# Altium schematic sheet УШЯИ.467444.130Э3_4.SchDoc
size 420 x 297 mm; SheetNumber: 4; SheetTotal: 5
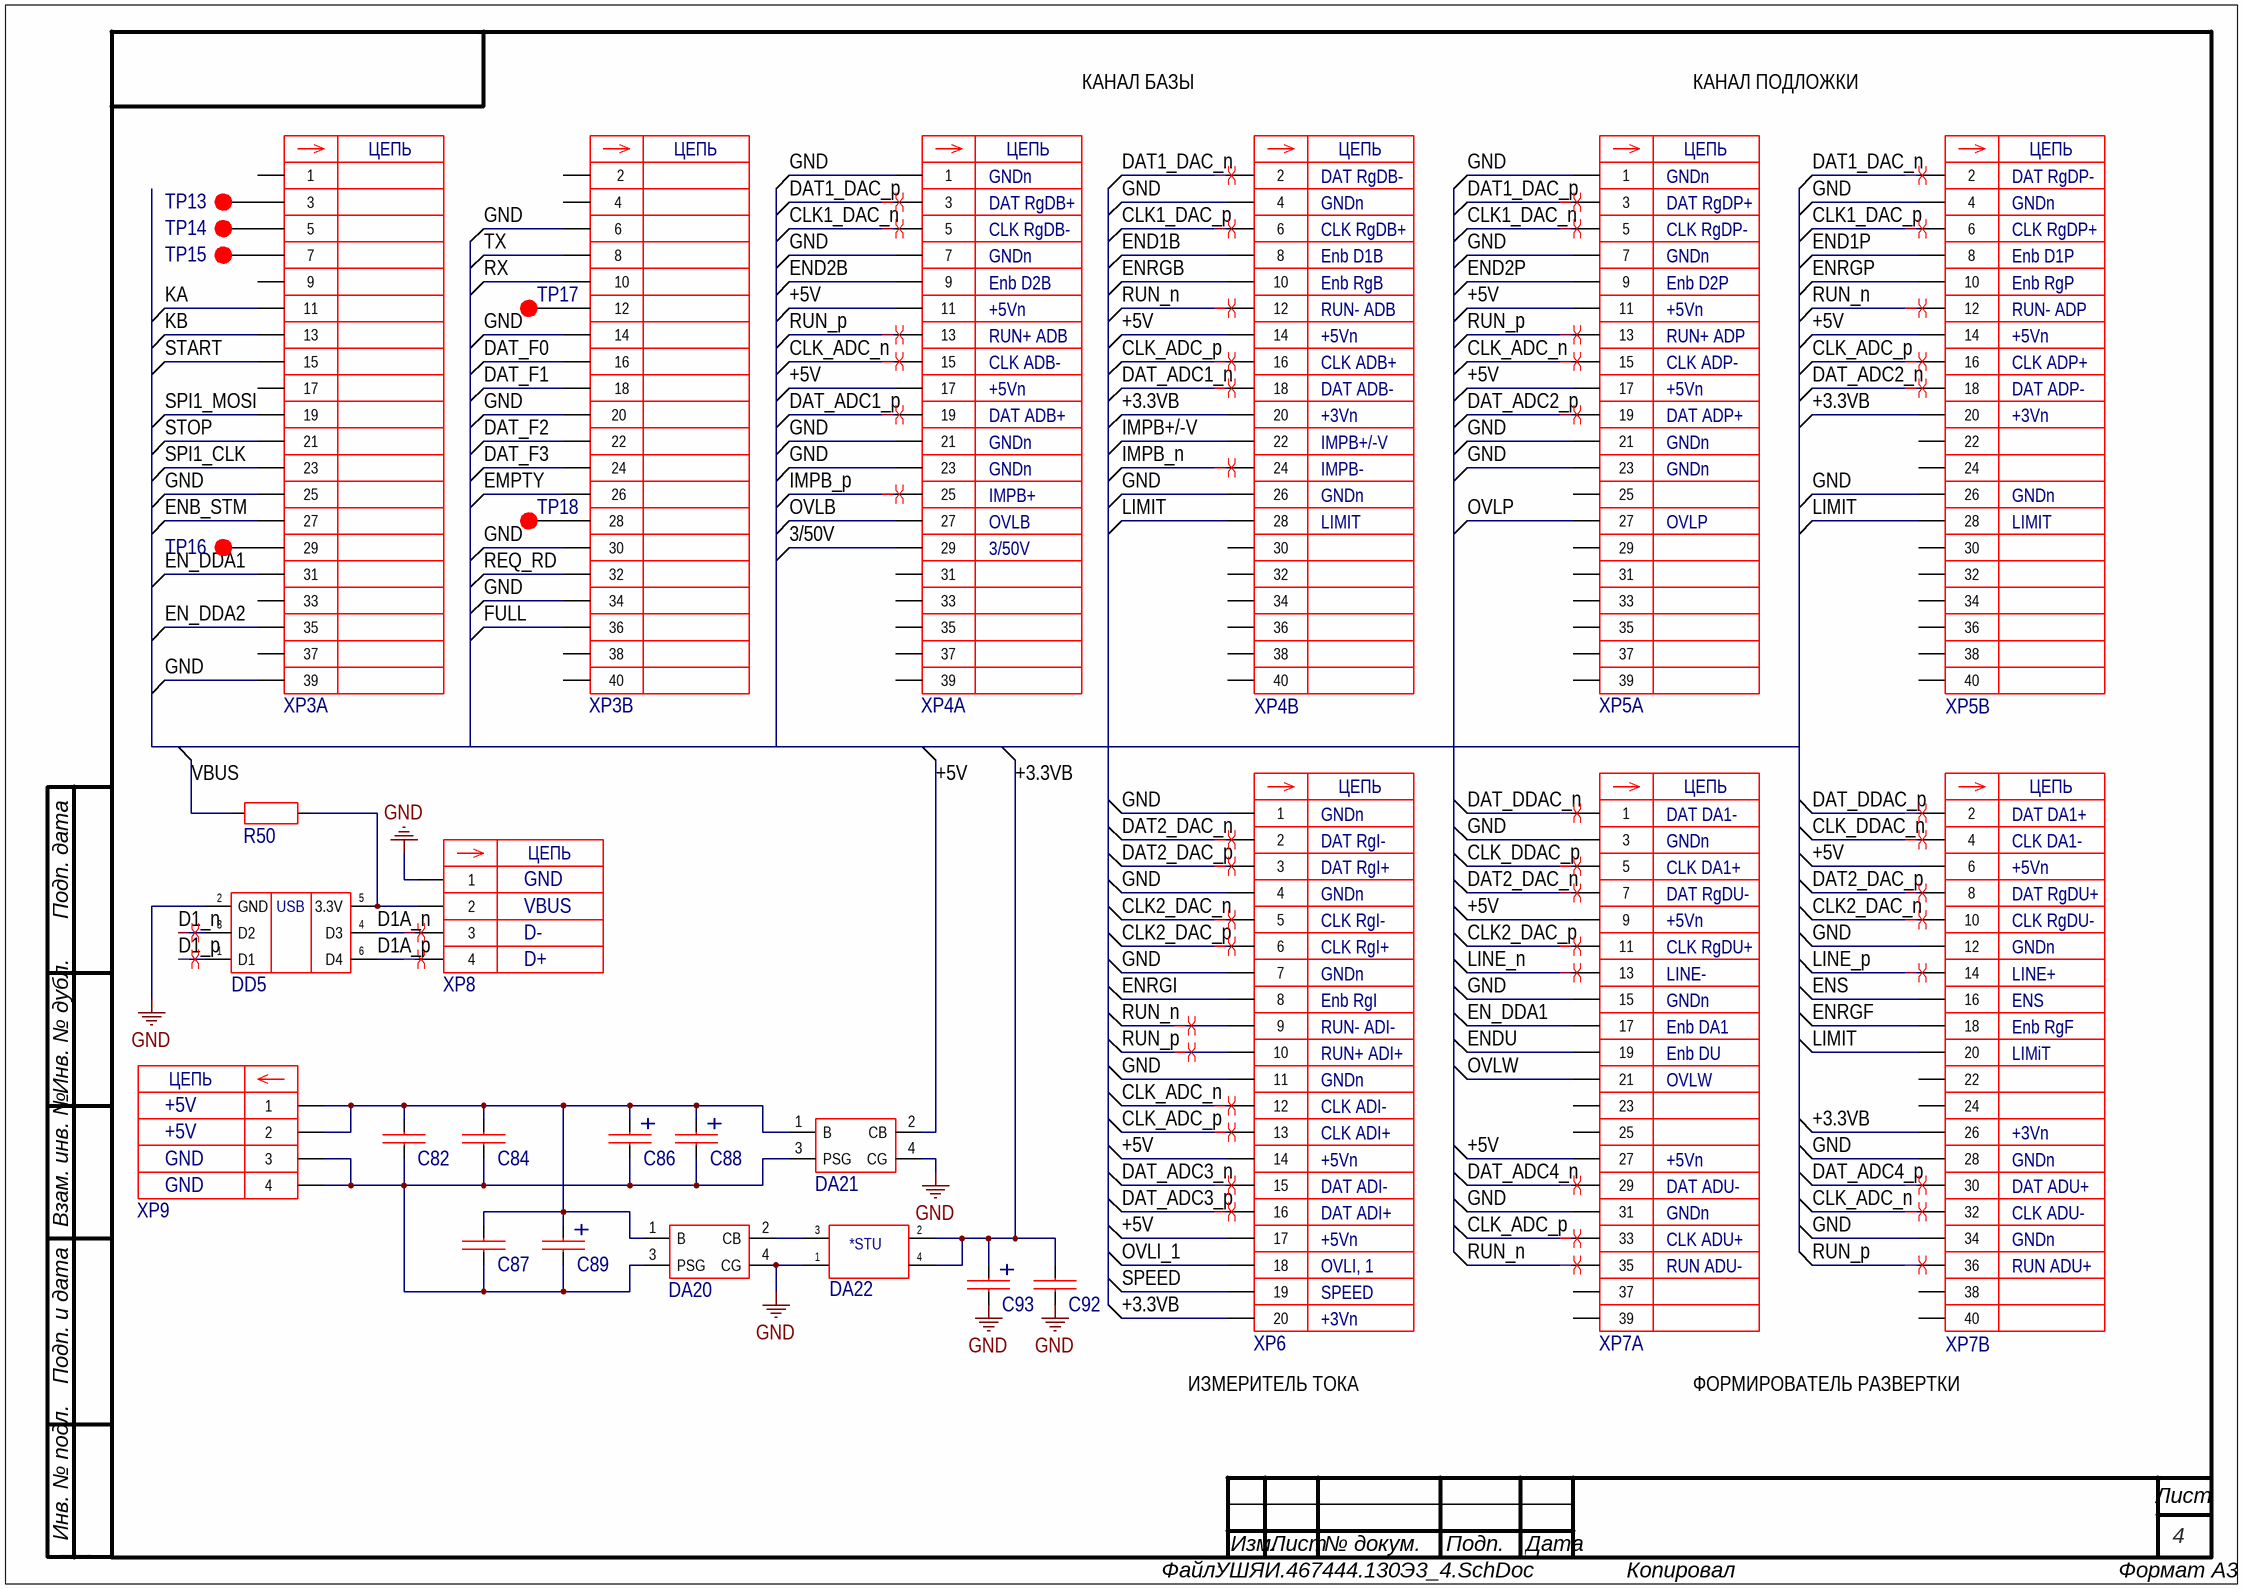
[diagram p0: УШЯИ.467444.130Э3_4.SchDoc]

## Parts
C82  0,1 µF  [C_0805 [2012 Metric]]  (value not drawn)
C84  0,1 µF  [C_0805 [2012 Metric]]  (value not drawn)
C86  1000 µF  [С_EXR_10x21]  (value not drawn)
C87  0,1 µF  [C_0805 [2012 Metric]]  (value not drawn)
C88  10 µF  [C+_1210 [3528-21 Metric]]  (value not drawn)
C89  10 µF  [C+_1210 [3528-21 Metric]]  (value not drawn)
C92  0,1 µF  [C_0805 [2012 Metric]]  (value not drawn)
C93  10 µF  [C+_1210 [3528-21 Metric]]  (value not drawn)
DA20  BNX028-01  [F_BNX028-01]  (value not drawn)
DA21  BNX028-01  [F_BNX028-01]  (value not drawn)
DA22  LD1117AS33TR  [SOT-223]  (value not drawn)
DD5  USBUF01W6  [SOT-323-6]  (value not drawn)
R50  30R  [R_0805 [2012 Metric]]  (value not drawn)
TP13  (no value)  [DSP_1.3]  (no BOM)
TP14  (no value)  [DSP_1.3]  (no BOM)
TP15  (no value)  [DSP_1.3]  (no BOM)
TP16  (no value)  [DSP_1.3]  (no BOM)
TP17  (no value)  [DSP_1.3]  (no BOM)
TP18  (no value)  [DSP_1.3]  (no BOM)
XP3  BH-40  [BH-40]  (value not drawn)  (parts A,B of 2)
XP4  BH2-40  [BH2-40]  (value not drawn)  (parts A,B of 2)
XP5  BH2-40  [BH2-40]  (value not drawn)  (parts A,B of 2)
XP6  BH2-20R  [BH2-20R]  (value not drawn)
XP7  BH2-40  [BH2-40]  (value not drawn)  (parts A,B of 2)
XP8  AMPMODU II 280371-2  [AMP II-280371-2]  (value not drawn)
XP9  AMPMODU II 280371-2  [AMP II-280371-2]  (value not drawn)

## Nets
GND: C92.1 C93.- DA20.4(CG) DA21.4(CG) DA22.1(ADJ/GND) DD5.2(GND) XP3.6 XP3.14 XP3.20 XP3.25 XP3.30 XP3.34 XP3.39 XP4.1 XP4.4 XP4.7 XP4.21 XP4.23 XP4.26 XP5.1 XP5.4 XP5.7 XP5.21 XP5.23 XP5.26 XP6.1 XP6.4 XP6.7 XP6.11 XP7.3 XP7.12 XP7.15 XP7.28 XP7.31 XP7.34 XP8.1
3/50V: XP4.29
+3.3VB: C92.2 C93.+ DA22.2(VOUT) DA22.4(VOUT) XP4.20 XP5.20 XP6.20 XP7.26
+5V: DA21.2(CB) XP4.11 XP4.14 XP4.17 XP5.11 XP5.14 XP5.17 XP6.14 XP6.17 XP7.6 XP7.9 XP7.27
CLK1_DAC_n: XP4.5 XP5.5
CLK1_DAC_p: XP4.6 XP5.6
CLK2_DAC_n: XP6.5 XP7.10
CLK2_DAC_p: XP6.6 XP7.11
CLK_ADC_n: XP4.15 XP5.15 XP6.12 XP7.32
CLK_ADC_p: XP4.16 XP5.16 XP6.13 XP7.33
CLK_DDAC_n: XP7.4
CLK_DDAC_p: XP7.5
D1_n: DD5.3(D2)
D1_p: DD5.1(D1)
D1A_n: DD5.4(D3) XP8.3
D1A_p: DD5.6(D4) XP8.4
DAT1_DAC_n: XP4.2 XP5.2
DAT1_DAC_p: XP4.3 XP5.3
DAT2_DAC_n: XP6.2 XP7.7
DAT2_DAC_p: XP6.3 XP7.8
DAT_ADC1_n: XP4.18
DAT_ADC1_p: XP4.19
DAT_ADC2_n: XP5.18
DAT_ADC2_p: XP5.19
DAT_ADC3_n: XP6.15
DAT_ADC3_p: XP6.16
DAT_ADC4_n: XP7.29
DAT_ADC4_p: XP7.30
DAT_DDAC_n: XP7.1
DAT_DDAC_p: XP7.2
DAT_F0: XP3.16
DAT_F1: XP3.18
DAT_F2: XP3.22
DAT_F3: XP3.24
EMPTY: XP3.26
EN_DDA1: XP3.31 XP7.17
EN_DDA2: XP3.35
ENB_STM: XP3.27
END1B: XP4.8
END1P: XP5.8
END2B: XP4.9
END2P: XP5.9
ENDU: XP7.19
ENRGB: XP4.10
ENRGF: XP7.18
ENRGI: XP6.8
ENRGP: XP5.10
ENS: XP7.16
FULL: XP3.36
IMPB+/-V: XP4.22
IMPB_n: XP4.24
IMPB_p: XP4.25
KA: XP3.11
KB: XP3.13
LIMIT: XP4.28 XP5.28 XP7.20
LINE_n: XP7.13
LINE_p: XP7.14
OVLB: XP4.27
OVLI_1: XP6.18
OVLP: XP5.27
OVLW: XP7.21
REQ_RD: XP3.32
RUN_n: XP4.12 XP5.12 XP6.9 XP7.35
RUN_p: XP4.13 XP5.13 XP6.10 XP7.36
RX: XP3.10
SPEED: XP6.19
SPI1_CLK: XP3.23
SPI1_MOSI: XP3.19
START: XP3.15
STOP: XP3.21
TX: XP3.8
VBUS: R50.1
NetC82_1: C82.1 C84.1 C86.+ C87.2 C88.+ C89.+ DA20.1(B) DA21.1(B) XP9.1 XP9.2
NetC82_2: C82.2 C84.2 C86.- C87.1 C88.- C89.- DA20.3(PSG) DA21.3(PSG) XP9.3 XP9.4
NetDA20_2: DA20.2(CB) DA22.3(VIN)
NetDD5_5: DD5.5(3.3V) R50.2 XP8.2
NetTP13_1: TP13.1 XP3.3
NetTP14_1: TP14.1 XP3.5
NetTP15_1: TP15.1 XP3.7
NetTP16_1: TP16.1 XP3.29
NetTP17_1: TP17.1 XP3.12
NetTP18_1: TP18.1 XP3.28

Not connected (* = marked no-connect by the designer): XP3 1 2 4 9 17 33 37 38 40; XP4 30 31 32 33 34 35 36 37 38 39 40; XP5 22 24 25 29 30 31 32 33 34 35 36 37 38 39 40; XP7 22 23 24 25 37 38 39 40

## Layout directives
differential pair: CLK1_DAC_n, CLK1_DAC_p, CLK2_DAC_n, CLK2_DAC_p, CLK_ADC_n, CLK_ADC_p, CLK_DDAC_n, CLK_DDAC_p, D1_n, D1_p, D1A_n, D1A_p, DAT1_DAC_n, DAT1_DAC_p, DAT2_DAC_n, DAT2_DAC_p, DAT_ADC1_n, DAT_ADC1_p, DAT_ADC2_n, DAT_ADC2_p, DAT_ADC3_n, DAT_ADC3_p, DAT_ADC4_n, DAT_ADC4_p, DAT_DDAC_n, DAT_DDAC_p, IMPB_n, IMPB_p, LINE_n, LINE_p, RUN_n, RUN_p

## Notes on the sheet
- КАНАЛ БАЗЫ
- КАНАЛ ПОДЛОЖКИ
- GNDn
- DAT RgDB-
- DAT RgDP-
- DAT RgDB+
- CLK RgDB-
- CLK RgDB+
- DAT RgDP+
- CLK RgDP-
- CLK RgDP+
- +5Vn
- Enb D2B
- RUN- ADB
- Enb D1B
- Enb RgB
- Enb D2P
- RUN- ADP
- Enb D1P
- Enb RgP
- RUN+ ADB
- CLK ADB-
- DAT ADB-
- CLK ADB+
- RUN+ ADP
- CLK ADP-
- DAT ADP-
- CLK ADP+
- DAT ADB+
- IMPB+/-V
- +3Vn
- DAT ADP+
- OVLB
- IMPB+
- LIMIT
- IMPB-
- OVLP
- 3/50V
- DAT RgI-
- DAT DA1-
- DAT DA1+
- CLK DA1-
- GND
- VBUS
- DAT RgI+
- CLK RgI-
- CLK DA1+
- DAT RgDU-
- CLK RgDU-
- DAT RgDU+
- D-
- D+
- CLK RgI+
- CLK RgDU+
- LINE-
- LINE+
- Enb RgI
- RUN- ADI-
- RUN+ ADI+
- Enb DA1
- Enb DU
- ENS
- Enb RgF
- LIMiT
- +5V
- CLK ADI-
- OVLW
- CLK ADI+
- DAT ADI-
- DAT ADU-
- DAT ADU+
- DAT ADI+
- OVLI, 1
- CLK ADU+
- RUN ADU-
- CLK ADU-
- RUN ADU+
- SPEED
- ИЗМЕРИТЕЛЬ ТОКА
- ФОРМИРОВАТЕЛЬ РАЗВЕРТКИ
- Подп. дата
- Инв. № дубл.
- Взам. инв. №
- Подп. и дата
- Инв. № подл.
- Изм.
- Лист
- № докум.
- Подп.
- Дата
- ALTIUM GOSTBOM2.0 KEV
- Файл:
- Копировал
- Формат А3
- (in symbol Conn_3) ЦЕПЬ
- (in symbol Conn_29, part A) ЦЕПЬ
- (in symbol Conn_29, part B) ЦЕПЬ
- (in symbol Conn_30, part A) ЦЕПЬ
- (in symbol Conn_30, part B) ЦЕПЬ
- (in symbol Conn_31) ЦЕПЬ
- (in symbol IC_1) *STU
- (in symbol IC_5) USB

## Library data of the parts
C82 C84 C87 C92 = Cap_60: Неполярный конденсатор; Manufacturer: Murata; ID: Cap_60; Component Name: Конденсатор GRM21BR71H104KA01L; Voltage: 50V; Tolerance: ±10%; Datasheet: https://www.murata.com/en-eu/products/productdetail?partno=GRM21BR71H104KA01%23; Capacitance: 0,1 µF; Case / Package: 0805 [2012 Metric]; Height: 1.4mm; Weight, kg: 0,000006
C86 = Cap_70: Полярный конденсатор; Manufacturer: Hitano; ID: Cap_70; Component Name: Конденсатор EXR102M16B; Voltage: 16V; Tolerance: ± 20%; Datasheet: chrome-extension://efaidnbmnnnibpcajpcglclefindmkaj/https://static.chipdip.ru/lib/934/DOC044934708.pdf; Capacitance: 1000 µF; Height: 21mm; Weight, kg: 0,003
C88 C89 C93 = Cap_56: Полярный конденсатор; Manufacturer: KYOCERA AVX; ID: Cap_56; Component Name: Конденсатор TAJB106M020; Voltage: 20V / 10V; Tolerance: ±20%; Datasheet: https://datasheets.kyocera-avx.com/TAJ.pdf; Capacitance: 10 µF; Case / Package: 1210 [3528-21 Metric]; Height: 2mm; Weight, kg: 0,000016
DA20 DA21 = Filt_2: 16В, 35дБ; Manufacturer: Murata Electronics; ID: Filt_2; Component Name: Фильтр BNX028-01; Current: 20А; Datasheet: https://static.chipdip.ru/lib/614/DOC034614186.pdf; Height: 3.7mm; Weight, kg: 0,001; Device: BNX028-01
DA22 = IC_1: IC, Fixed LDO Voltage Regulator, 5.3V to 10V, 1.15V Dropout, 3.3Vout, 1Aout; Manufacturer: STMicroelectronics; ID: IC_1; Component Name: Микросхема LD1117AS33TR; Catalogue: DIGI-KEY 497-1228-2-ND; Device: LD1117AS33TR; Datasheet: https://www.st.com/content/ccc/resource/technical/document/datasheet/a5/c3/3f/c9/2b/15/40/49/CD00002116.pdf/files/CD00002116.pdf/jcr:content/translations/en.CD00002116.pdf; Case / Package: SOT-223; Height: 1.9mm; Weight, kg: 0,0045
DD5 = IC_5: EMI Filter, 2-Channel, USB Upstream Terminator, ESD Protection; Manufacturer: STMicroelectronics; ID: IC_5; Component Name: Микросхема USBUF01W6; Catalogue: FARNELL 2341662; Device: USBUF01W6; Datasheet: https://www.farnell.com/datasheets/1964274.pdf; Case / Package: SOT-323-6; Height: 1.1mm; Weight, kg: 0,000006
R50 = Res_89: ID: Res_89; Component Name: Резистор 0805-30 Ом ±5%; Tolerance: ±5%; Resistance: 30R; Case / Package: 0805 [2012 Metric]; Height: 0.7mm; Weight, kg: 0,000006
TP13-TP18 = Pad_13: ID: Pad_13; Component Name: TP_DSP_1.3
XP3 = Conn_30: Male, 40 pins, 2 rows, Vertical, DS1013-40S, 2.54 mm; Manufacturer: Connfly electronic; Component Name: Вилка BH-40; Catalogue: ChipDip 57941; Крепёж: Не нужно; ID: Conn_30; Device: BH-40; Datasheet: https://static.chipdip.ru/lib/525/DOC059525716.pdf; Height: 9.1mm; Weight, kg: 0,0045
XP4 XP5 XP7 = Conn_29: Male, 40 pins, 2 rows, Vertical, DS1014-40, 2 mm; Manufacturer: Connfly electronic; Component Name: Вилка BH2-40; Catalogue: ChipDip 9000019617; Крепёж: Не нужно; ID: Conn_29; Device: BH2-40; Datasheet: https://static.chipdip.ru/lib/525/DOC059525726.pdf; Height: 5.8mm; Weight, kg: 0,0014
XP6 = Conn_31: Male, 20 pins, 2 rows, Right Angle, DS1014-20RF1B-B, 2 mm; Manufacturer: Connfly electronic; Component Name: Вилка BH2-20R; Catalogue: ChipDip 8027300167; Крепёж: Не нужно; ID: Conn_31; Device: BH2-20R; Datasheet: https://static.chipdip.ru/lib/525/DOC059525726.pdf; Height: 5.6mm; Weight, kg: 0,0016
XP8 XP9 = Conn_3: Male, 4 pin, 1 row, Vertical, Board-to-Board, 2.54 mm; Manufacturer: TE Connectivity; ID: Conn_3; Component Name: Вилка AMPMODU II 280371-2; Catalogue: TE Internal 280371-2; Крепёж: Не нужно; Device: AMPMODU II 280371-2; Datasheet: https://www.te.com/usa-en/product-280371-2.datasheet.pdf; Height: 12.8mm; Weight, kg: 0,001